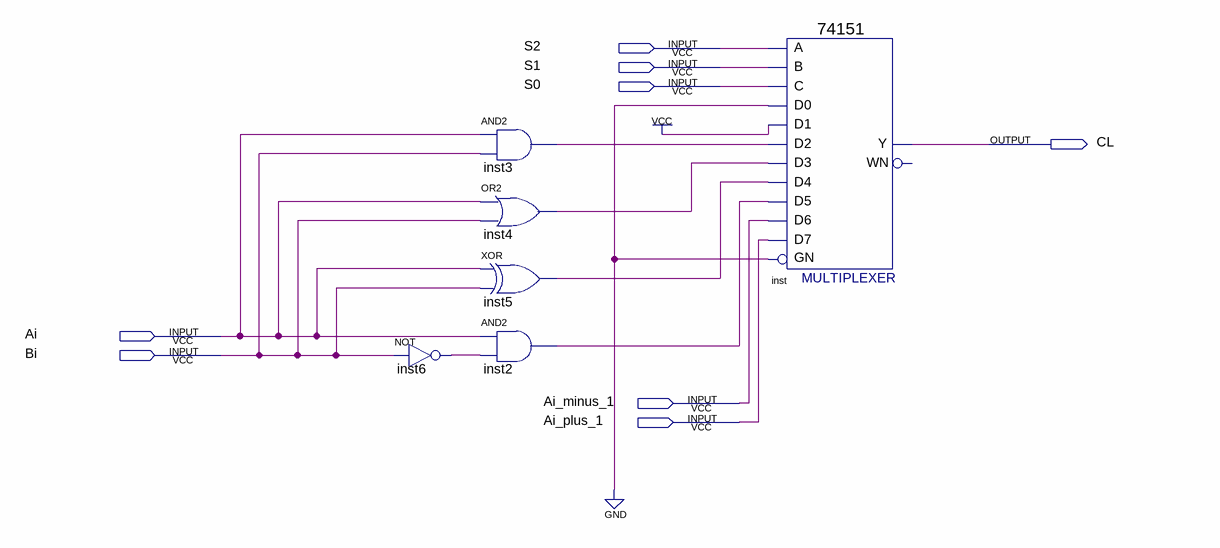
[diagram p0: schematic sheet]
// Quartus schematic logiccircuit1bit.bdf as structural Verilog: 6 symbols, 8 pins
module logiccircuit1bit (
  input  S2,
  input  S1,
  input  S0,
  input  Ai,
  input  Bi,
  input  Ai_minus_1,
  input  Ai_plus_1,
  output CL
);

  wire inst2_out, inst3_out, inst4_out, inst5_out, inst6_out;

  not inst6 (inst6_out, Bi);
  and inst3 (inst3_out, Ai, Bi);
  or inst4 (inst4_out, Ai, Bi);
  xor inst5 (inst5_out, Ai, Bi);
  and inst2 (inst2_out, Ai, inst6_out);
  \74151  inst (
    .GN(1'b0), .C(S0), .B(S1), .A(S2), .D5(inst2_out), .D0(1'b0), .D1(1'b1), .D4(inst5_out), .D3(inst4_out),
    .D2(inst3_out), .D6(Ai_minus_1), .D7(Ai_plus_1), .Y(CL));  // open: WN
endmodule
